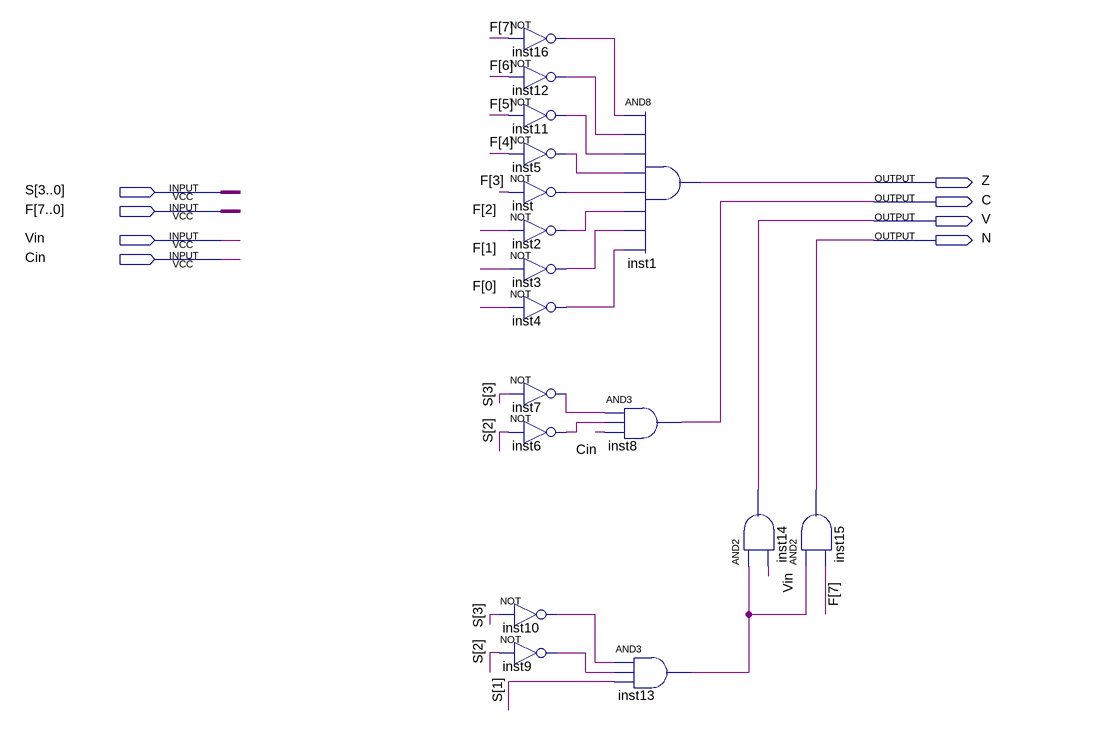
[diagram p0: schematic sheet]
// Quartus schematic FlagUnit.bdf as structural Verilog: 17 symbols, 8 pins
module FlagUnit (
  input  [3:0] S,
  input  [7:0] F,
  input  Vin,
  input  Cin,
  output Z,
  output C,
  output V,
  output N
);

  wire inst2_out, inst3_out, inst4_out, inst5_out, inst6_out, inst7_out, inst9_out, inst10_out, inst11_out,
       inst12_out, inst13_out, inst16_out, inst_out;

  not inst16 (inst16_out, F[7]);
  not inst12 (inst12_out, F[6]);
  not inst11 (inst11_out, F[5]);
  not inst5 (inst5_out, F[4]);
  not inst (inst_out, F[3]);
  not inst2 (inst2_out, F[2]);
  not inst3 (inst3_out, F[1]);
  not inst4 (inst4_out, F[0]);
  not inst7 (inst7_out, S[3]);
  not inst6 (inst6_out, S[2]);
  not inst10 (inst10_out, S[3]);
  not inst9 (inst9_out, S[2]);
  and inst8 (C, inst7_out, inst6_out, Cin);
  and inst13 (inst13_out, inst10_out, inst9_out, S[1]);
  and inst1 (Z, inst16_out, inst12_out, inst11_out, inst5_out, inst_out, inst2_out, inst3_out, inst4_out);
  and inst14 (V, inst13_out, Vin);
  and inst15 (N, inst13_out, F[7]);
endmodule
